# EAGLE design rfm69_32u4_pa (EAGLE 8.2.2)
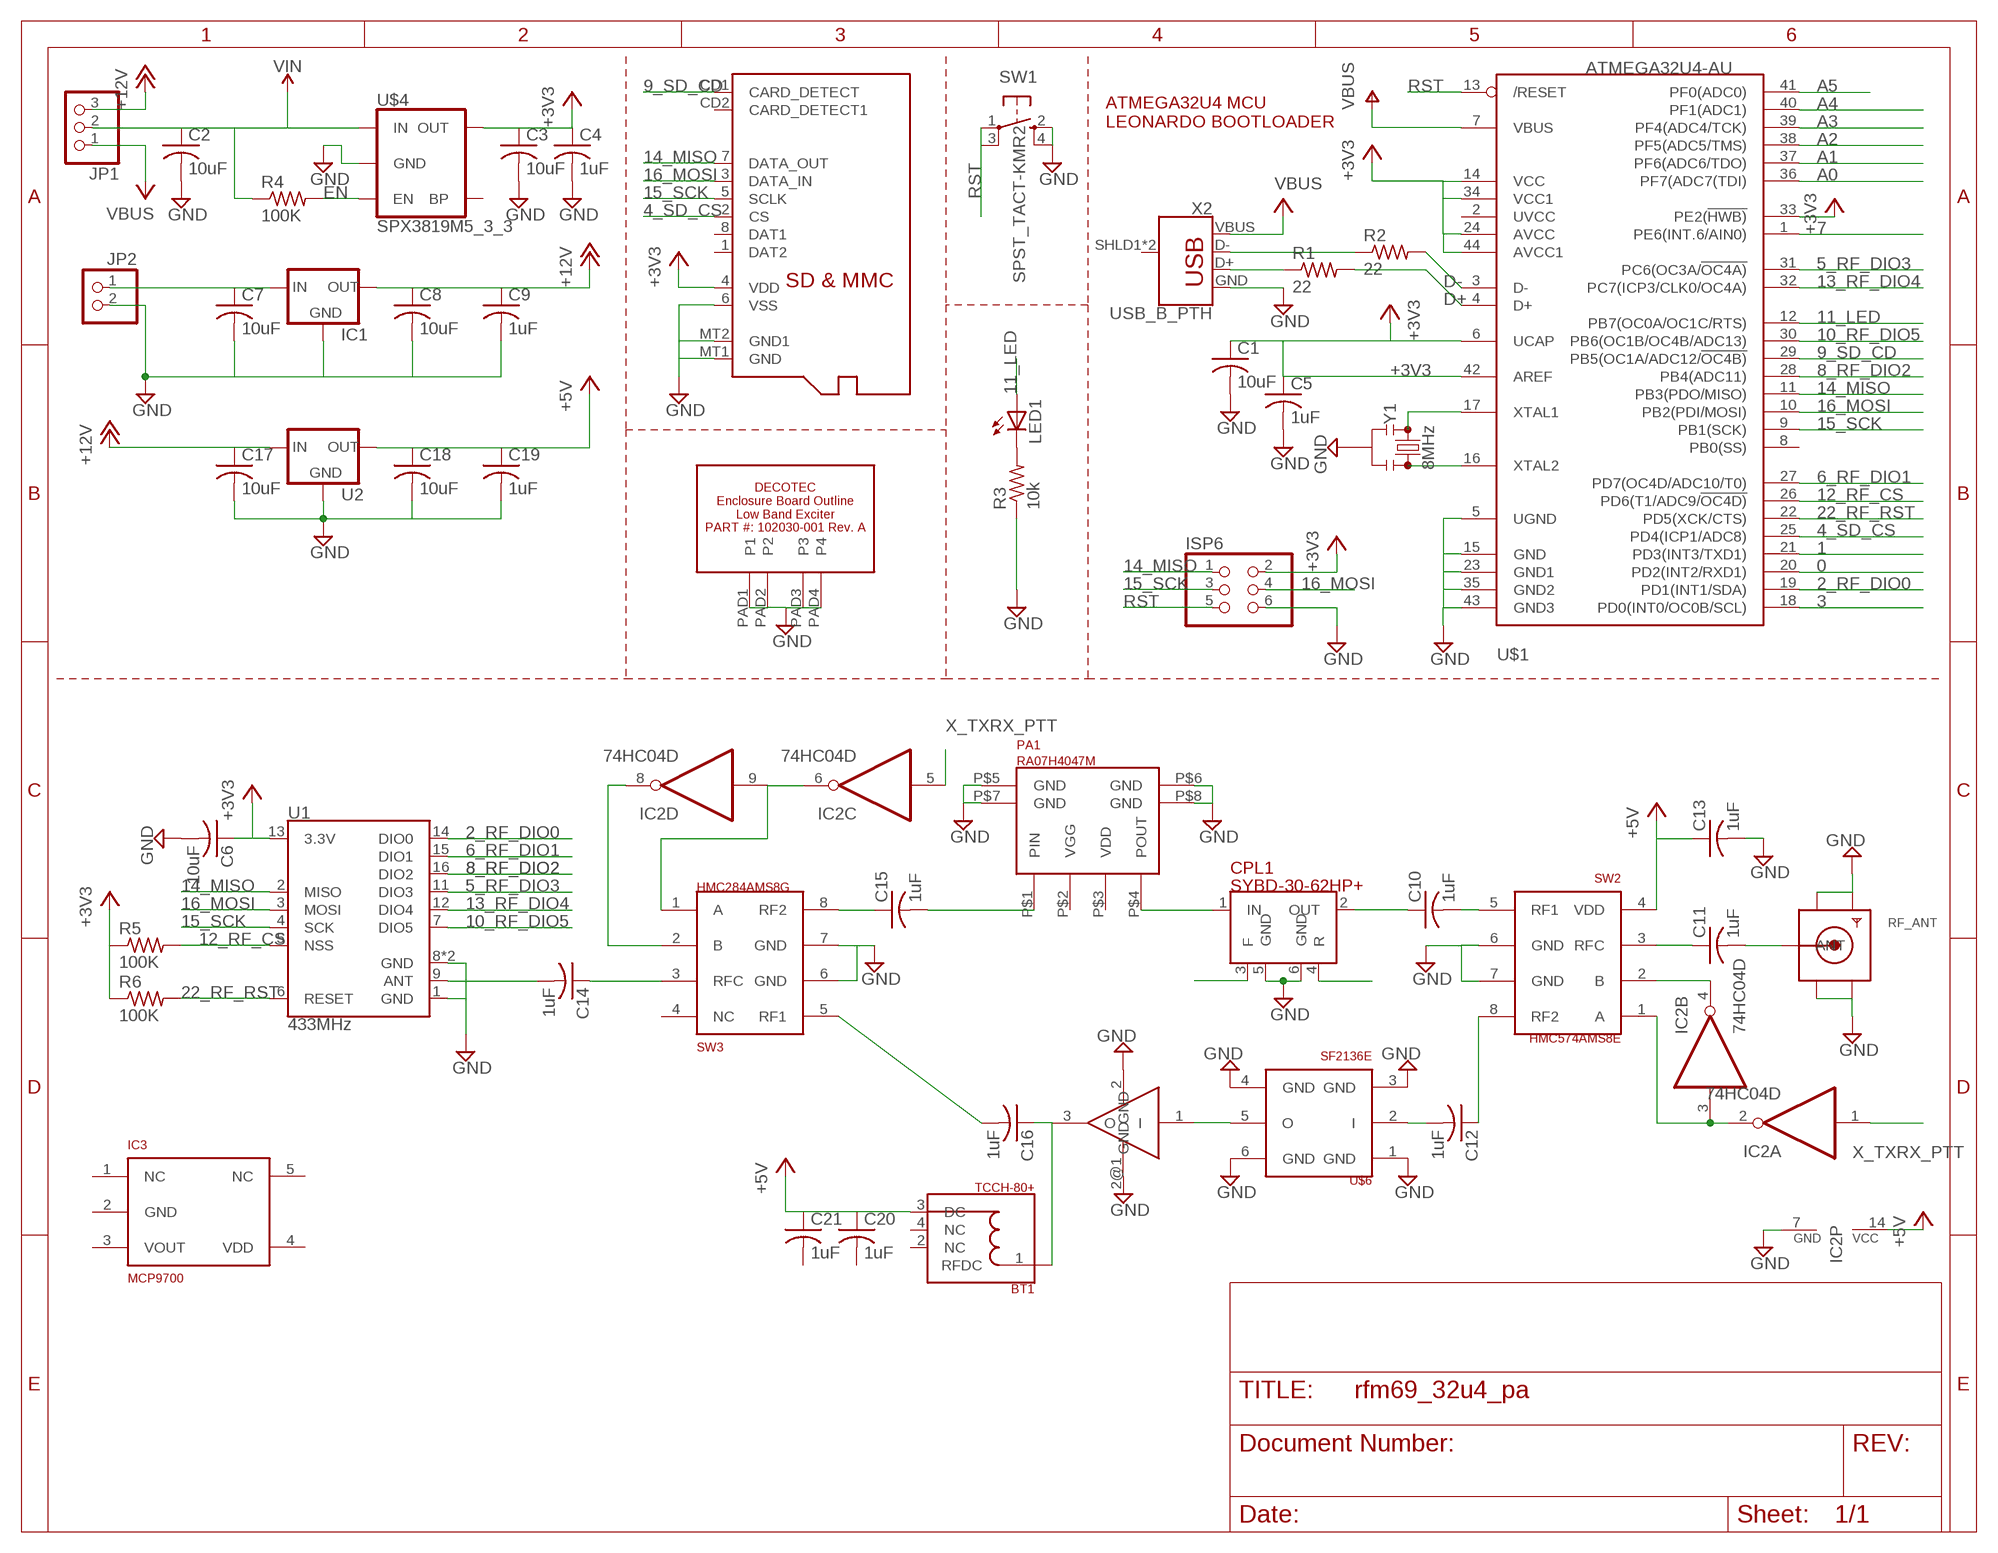
[diagram p0: schematic, sheet 1]

## Parts
BT1  TCCH-80+  [TCCH-80+]
C1  10uF  C-USC0805K  [C0805K]
C2  10uF  C-USC0805K  [C0805K]
C3  10uF  C-USC0805K  [C0805K]
C4  1uF  C-USC0805K  [C0805K]
C5  1uF  C-USC0805K  [C0805K]
C6  10uF  C-USC0805K  [C0805K]
C7  10uF  C-USC0805K  [C0805K]
C8  10uF  C-USC0805K  [C0805K]
C9  1uF  C-USC0805K  [C0805K]
C10  1uF  C-USC0805K  [C0805K]
C11  1uF  C-USC0805K  [C0805K]
C12  1uF  C-USC0805K  [C0805K]
C13  1uF  C-USC0805K  [C0805K]
C14  1uF  C-USC0805K  [C0805K]
C15  1uF  C-USC0805K  [C0805K]
C16  1uF  C-USC0805K  [C0805K]
C17  10uF  C-USC0805K  [C0805K]
C18  10uF  C-USC0805K  [C0805K]
C19  1uF  C-USC0805K  [C0805K]
C20  1uF  C-USC0805K  [C0805K]
C21  1uF  C-USC0805K  [C0805K]
CPL1  SYBD-30-62HP+  [SYBD-30-62HP+]
IC1  78XXL  [78XXL]
IC2  74HC04D  [SO14]
IC3  MCP9700  [SC70]
ISP6  PINHD-2X3  [2X03]
JP1  PINHD-1X3  [1X03]
JP2  PINHD-1X2  [1X02]
LED1  LEDCHIPLED_0805  [CHIPLED_0805]
PA1  RA07H4047M  [H46]
R1  22  R-US_R0805  [R0805]
R2  22  R-US_R0805  [R0805]
R3  10k  R-US_R0805  [R0805]
R4  100K  R-US_R0805  [R0805]
R5  100K  R-US_R0805  [R0805]
R6  100K  R-US_R0805  [R0805]
RF_ANT  SMACONNECTOR_EDGE  [SMA_EDGELAUNCH]
SW1  SPST_TACT-KMR2  [KMR2]
SW2  HMC574AMS8E  [MSOP8]
SW3  HMC284AMS8G  [MSOP8]
U1  433MHz  RFM69HCW-433  [RFM69HCW-XXXS2]
U2  V_REG_78XX-TO-220  [TO-220-ALT]
U$1  ATMEGA32U4-AU  [TQFP44]
U$2  DECOTEC_102030-001A  [DECOTEC_102030-001A]
U$3  MICROSD  [MICROSD]
U$4  SPX3819M5_3_3  V_REG_SPX3819-SOT23-5  [SOT23-5]
U$5  PGA-103+  [SOT89]
U$6  SF2136E  [SM3030-6]
X2  USB_B_PTH  [USB-B-PTH]
Y1  8MHz  RESONATOR-8MHZSMD_3.2X1.3  [RESONATOR-SMD-3.2X1.3]

## Nets
0: U$1.20(PD2(INT2/RXD1))
1: U$1.21(PD3(INT3/TXD1))
2_RF_DIO0: U1.14(DIO0) U$1.19(PD1(INT1/SDA))
3: U$1.18(PD0(INT0/OC0B/SCL))
4_SD_CS: U$1.25(PD4(ICP1/ADC8)) U$3.2(CS)
5_RF_DIO3: U1.11(DIO3) U$1.31(PC6(OC3A/!OC4A))
6_RF_DIO1: U1.15(DIO1) U$1.27(PD7(OC4D/ADC10/T0))
7: U$1.1(PE6(INT.6/AIN0))
8_RF_DIO2: U1.16(DIO2) U$1.28(PB4(ADC11))
9_SD_CD: U$1.29(PB5(OC1A/ADC12/!OC4B)) U$3.CD1(CARD_DETECT)
10_RF_DIO5: U1.7(DIO5) U$1.30(PB6(OC1B/OC4B/ADC13))
11_LED: LED1.A U$1.12(PB7(OC0A/OC1C/RTS))
12_RF_CS: R5.2 U1.5(NSS) U$1.26(PD6(T1/ADC9/!OC4D))
13_RF_DIO4: U1.12(DIO4) U$1.32(PC7(ICP3/CLK0/OC4A))
14_MISO: ISP6.1 U1.2(MISO) U$1.11(PB3(PDO/MISO)) U$3.7(DATA_OUT)
15_SCK: ISP6.3 U1.4(SCK) U$1.9(PB1(SCK)) U$3.5(SCLK)
16_MOSI: ISP6.4 U1.3(MOSI) U$1.10(PB2(PDI/MOSI)) U$3.3(DATA_IN)
22_RF_RST: R6.2 U1.6(RESET) U$1.22(PD5(XCK/CTS))
+3V3: C1.1 C3.1 C4.1 C5.1 C6.1 ISP6.2 R5.1 R6.1 U1.13(3.3V) U$1.6(UCAP) U$1.14(VCC) U$1.24(AVCC) U$1.33(PE2(!HWB)) U$1.34(VCC1) U$1.42(AREF) U$1.44(AVCC1) U$3.4(VDD) U$4.5(OUT)
+5V: BT1.3(DC) C13.1 C18.1 C19.1 C20.1 C21.1 IC2.14(P:VCC) SW2.4(VDD) U2.OUT
+12V: C8.1 C9.1 C17.1 IC1.OUT JP1.3 U2.IN
A0: U$1.36(PF7(ADC7(TDI))
A1: U$1.37(PF6(ADC6/TDO))
A2: U$1.38(PF5(ADC5/TMS))
A3: U$1.39(PF4(ADC4/TCK))
A4: U$1.40(PF1(ADC1))
A5: U$1.41(PF0(ADC0))
ANT: C14.2 U1.9(ANT)
CPL_FWD: CPL1.3(F)
CPL_REV: CPL1.4(R)
D+: R1.2 U$1.4(D+)
D-: R2.2 U$1.3(D-)
EN: R4.2 U$4.3(EN)
GND: C1.2 C2.2 C3.2 C4.2 C5.2 C6.2 C7.2 C8.2 C9.2 C13.2 C17.2 C18.2 C19.2 CPL1.5(GND) CPL1.6(GND) IC1.GND IC2.7(P:GND) ISP6.6 JP2.2 PA1.P$5(GND) PA1.P$6(GND) PA1.P$7(GND) PA1.P$8(GND) R3.1 RF_ANT.GND@1(GND4) RF_ANT.GND@2(GND3) RF_ANT.GND@3(GND2) RF_ANT.GND@4(GND1) SW1.2(S) SW1.4(S1) SW2.6(GND) SW2.7(GND) SW3.6(GND) SW3.7(GND) U1.1(GND) U1.8(GND) U1.10(GND) U2.GND U$1.5(UGND) U$1.15(GND) U$1.23(GND1) U$1.35(GND2) U$1.43(GND3) U$2.PAD1(P1) U$2.PAD2(P2) U$2.PAD3(P3) U$2.PAD4(P4) U$3.6(VSS) U$3.MT1(GND) U$3.MT2(GND1) U$4.2(GND) U$5.2(GND) U$5.2@1(GND) U$6.1(GND) U$6.3(GND) U$6.4(GND) U$6.6(GND) X2.GND Y1.2
N$1: R1.1 X2.D+
N$2: LED1.C R3.2
N$3: R2.1 X2.D-
N$4: C10.2 SW2.5(RF1)
N$5: C7.1 IC1.IN JP2.1
N$7: C12.1 SW2.8(RF2)
N$8: IC2.2(A:O) IC2.3(B:I) SW2.1(A)
N$9: IC2.4(B:O) SW2.2(B)
N$10: U$5.1(I) U$6.5(O)
N$11: C11.2 RF_ANT.P(ANT)
N$12: C11.1 SW2.3(RFC)
N$13: C14.1 SW3.3(RFC)
N$14: C15.1 SW3.8(RF2)
N$15: C15.2 PA1.P$1(PIN)
N$16: IC2.6(C:O) IC2.9(D:I) SW3.1(A)
N$17: BT1.1(RFDC) C16.1 U$5.3(O)
N$18: IC2.8(D:O) SW3.2(B)
N$19: C16.2 SW3.5(RF1)
N$20: C12.2 U$6.2(I)
RF_IN: CPL1.1(IN) PA1.P$4(POUT)
RF_OUT: C10.1 CPL1.2(OUT)
RST: ISP6.5 SW1.1(P) SW1.3(P1) U$1.13(/RESET)
VBUS: JP1.1 U$1.7(VBUS) X2.VBUS
VIN: C2.1 JP1.2 R4.1 U$4.1(IN)
X_TXRX_PTT: IC2.1(A:I) IC2.5(C:I)
XTAL1: U$1.17(XTAL1) Y1.1
XTAL2: U$1.16(XTAL2) Y1.3
Unconnected: BT1.2(NC) BT1.4(NC) C20.2 C21.2 IC2.10(E:O) IC2.11(E:I) IC2.12(F:O) IC2.13(F:I) IC3.1(NC) IC3.2(GND) IC3.3(VOUT) IC3.4(VDD) IC3.5(NC) PA1.P$2(VGG) PA1.P$3(VDD) SW3.4(NC) U$1.2(UVCC) U$1.8(PB0(SS)) U$3.1(DAT2) U$3.8(DAT1) U$3.CD2(CARD_DETECT1) U$4.4(BP) X2.SHLD1(SHIELD) X2.SHLD2(SHIELD)

## Notes on the sheet
- ATMEGA32U4 MCU
  LEONARDO BOOTLOADER

## Library data of the parts
BT1 = kj4qlp:TCCH-80+
C1-C21 = rcl:C-US: CAPACITOR, American symbol
CPL1 = kj4qlp:SYBD-30-62HP+
IC1 = v-reg:78XXL: VOLTAGE REGULATOR
IC2 = 74xx-eu:74*04: Hex INVERTER
IC3 = vtgs:MCP9700
ISP6 = pinhead:PINHD-2X3: PIN HEADER
JP1 = pinhead:PINHD-1X3: PIN HEADER
JP2 = pinhead:PINHD-1X2: PIN HEADER
LED1 = adafruit:LED: LED OSRAM: - CHIPLED LG R971, LG N971, LY N971, LG Q971, LY Q971, LO R971, LY R971 LH N974, LH R974 LS Q976, LO Q976, LY Q976 LO Q996 - Hyper CHIPLED LW Q18S LB Q993, LB Q99A, LB R99A - SideLED LS A670, LO A670, LY A670, LG A670, LP A670 LB A673, LV A673, LT A673, LW A673 LH A674 LY A675 LS A676, LA A676, LO A676, LY A676, LW A676 LS A679, LY A679, LG A679 - Hyper Micro SIDELED® LS Y876, LA Y876, LO Y876, LY Y876 LT Y87S - SmartLED LW L88C, LW L88S LB L89C, LB L89S, LG L890 LS L89K, LO L89K, LY L89K LS L896, LA L896, LO L896, LY L896 - TOPLED LS T670, LO T670, LY T670, LG T670, LP T670 LSG T670, LSP T670, LSY T670, LOP T670, LYG T670 LG T671, LOG T671, LSG T671 LB T673, LV T673, LT T673, LW T673 LH T674 LS T676, LA T676, LO T676, LY T676, LB T676, LH T676, LSB T676, LW T676 LB T67C, LV T67C, LT T67C, LS T67K, LO T67K, LY T67K, LW E67C LS E67B, LA E67B, LO E67B, LY E67B, LB E67C, LV E67C, LT E67C LW T67C LS T679, LY T679, LG T679 LS T770, LO T770, LY T770, LG T770, LP T770 LB T773, LV T773, LT T773, LW T773 LH T774 LS E675, LA E675, LY E675, LS T675 LS T776, LA T776, LO T776, LY T776, LB T776 LHGB T686 LT T68C, LB T68C - Hyper Mini TOPLED® LB M676 - Mini TOPLED Santana® LG M470 LS M47K, LO M47K, LY M47K Source: http://www.osram.convergy.de/
PA1 = kj4qlp:RA07H4047M
R1-R6 = adafruit:R-US_: RESISTOR, American symbol
RF_ANT = adafruit:SMACONNECTOR: SMA Connector 90° DIP SMA Connector, 50 Ohm (4UConnector: 07259)
SW1 = adafruit:SPST_TACT: SMT 6mm switch, EVQQ2 series http://www.ladyada.net/library/eagle
SW2 = kj4qlp:HMC574AMS8E
SW3 = kj4qlp:HMC284AMS8G
U1 = SparkFun-RF:RFM69H: Hope RF RFM69H ISM Transceiver Module The RFM69H is a transceiver module capable of operation over a wide frequency range, including the 315,433,868 and 915MHz license-free ISM (Industry Scientific and Medical) frequency bands. All major RF communication parameters are programmable and most of them can be dynamically set. The RFM69H offers the unique advantage of programmable narrow-band and wide- band communication modes. The RFM69H is optimized for low power consumption while offering high RF output power and channelized operation.Compliance ETSI and FCC regulations. Datasheet <http://www.hoperf.cn/upload/docs/RF/SX/RFM69H_DataSheet_v1.3.pdf> SparkFun Products RFM69HCW Wireless Transceiver - 915MHz <https://www.sparkfun.com/products/13909> (COM-13909) RFM69HCW Wireless Transceiver - 434MHz <https://www.sparkfun.com/products/13910> (COM-13910) SparkFun RFM69 Breakout (915MHz) <https://www.sparkfun.com/products/12775> (WRL-12775) SparkFun RFM69 Breakout (434MHz) <https://www.sparkfun.com/products/12823> (WRL-12823); PROD_ID: IC-12053
U2 = SparkFun-IC-Power:V_REG_78XX: Voltage Regulator Standard 78xx regulator. IGO (Input Ground Output). Spark Fun Electronics SKU : COM-00107; PROD_ID: VREG-08450; SF_ID: COM-00107
U$1 = adafruit:ATMEGA32U4: http://www.ladyada.net/library/eagle
U$2 = vtgs:DECOTEC_102030-001A
U$3 = adafruit:MICROSD: Micro-SD / Transflash card holder with SPI pinout For the 3M # 2908-05WB-MG and/or 4UCON #19656 push-push type
U$4 = SparkFun-IC-Power:V_REG_SPX3819: SPX3819 Voltage Regulator 3.3V 500mA, 16V input Datasheet <https://www.exar.com/content/document.ashx?id=22106> SparkFun Products: SparkFun Serial Controlled Motor Driver <https://www.sparkfun.com/products/13911>; PROD_ID: VREG-13321
U$5 = kj4qlp:PGA-103+
U$6 = kj4qlp:SF2136E
X2 = SparkFun-Connectors:USB_B: USB Type B Connector SparkFun Products: SparkFun Stepoko <https://www.sparkfun.com/products/13899> PTH; PROD_ID: CONN-08278; SF_ID: PRT-00139
Y1 = SparkFun-Clocks:RESONATOR-8MHZ: 8MHz Resonator Digikey Example <http://www.digikey.com/product-detail/en/murata-electronics-north-america/CSTCE10M0G55-R0/490-1196-1-ND/584633> Frequency: 8MHz Frequency Stability: ±0.2% Frequency Tolerance: ±0.5% Capacitance: 33pF SparkFun Products Arduino Pro Mini 328- 3.3V/8MHz <https://www.sparkfun.com/products/11114> SparkFun Digital Sandbox <https://www.sparkfun.com/products/12651>; PROD_ID: XTAL-08895

## Board
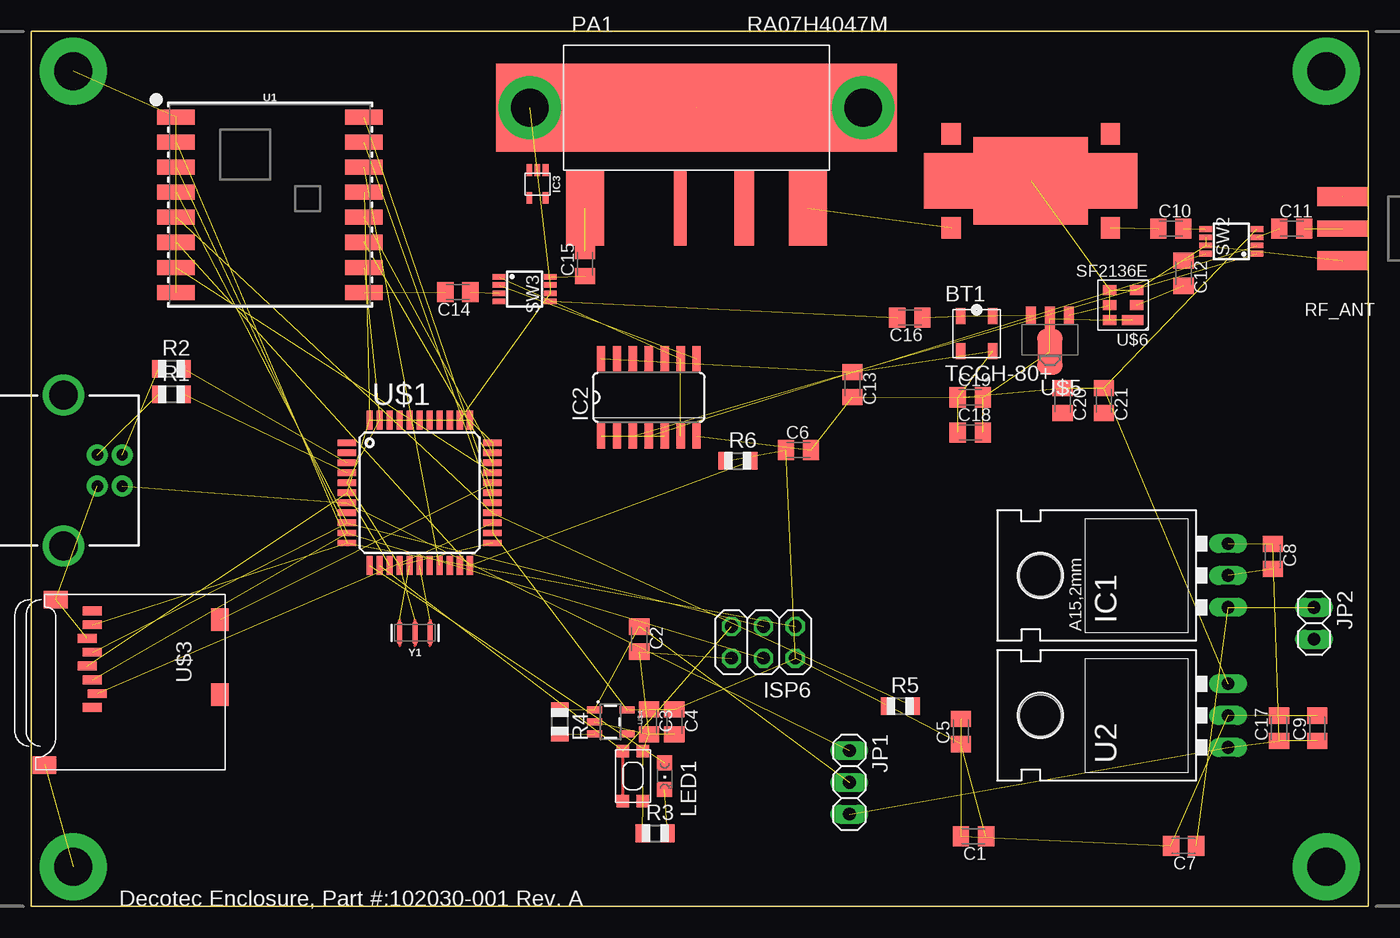
[diagram p1: board, top side]
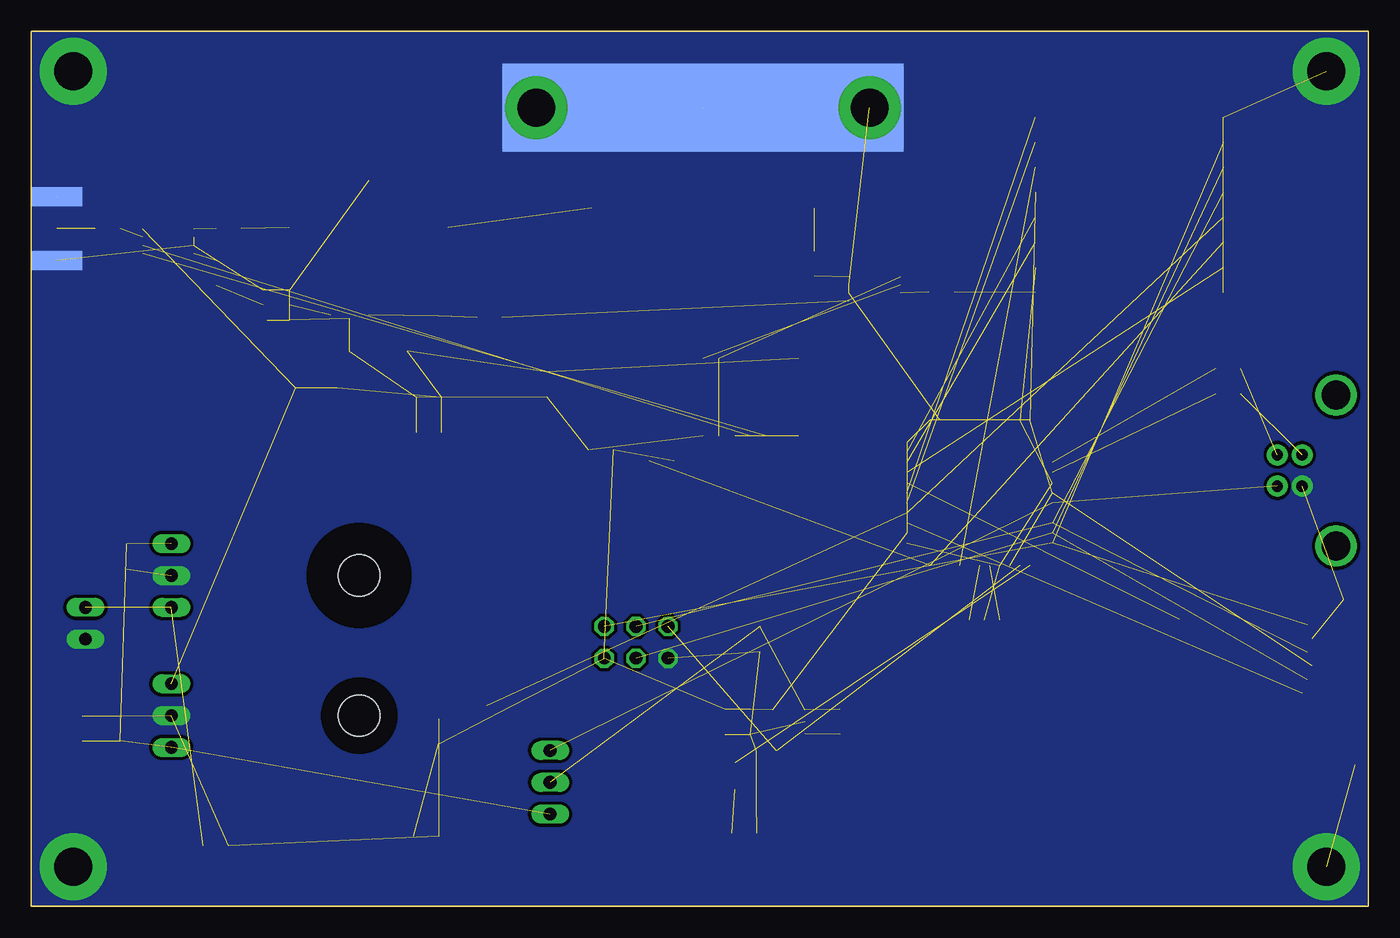
[diagram p2: board, bottom side, seen from below]

Size 106.68 x 69.85 mm. Coordinates in mm from the lower left corner, seen from the top.
Copper layers (1*16): Top 0.035mm / dielectric 1.5mm / Bottom 0.035mm
Design rules "default *": minimum track width 6mil, minimum drill 10mil, track to track 10mil, track to pad 6mil, pad to pad 6mil, via to via 6mil, smd to smd 6mil, copper to edge 1mil, drill to drill 6mil, minimum pad ring 10mil, minimum via ring 8mil, stop-mask expansion 4mil, vias tented up to drill 0mil, thermal gap 10mil

### Footprints (pad centres in the part's own frame; a part is rotated, then mirrored left to right if it is on the bottom)
TCCH-80+ = smd 0.762 x 1.27: 1 -1.27,1.397; 2 -1.27,-1.397; 3 1.27,-1.397; 4 1.27,1.397
C0805K = smd 1.3 x 1.6: 1 -1,0; 2 1,0
SYBD-30-62HP+ = smd 1.524 x 1.702: 1 -6.35,-3.747; 2 6.35,-3.747; 3 6.35,3.747; 4 -6.35,3.747 | smd 17.018 x 4.445: 5 0,0 | smd 9.144 x 6.985: 6 0,0
78XXL = drill 1.016 long: GND 0,-3.81; IN -2.54,-3.81; OUT 2.54,-3.81 | hole 3.302: 0,11.176
SO14 = smd 0.66 x 2.032: 1 -3.81,-3.073; 2 -2.54,-3.073; 3 -1.27,-3.073; 4 0,-3.073; 5 1.27,-3.073; 6 2.54,-3.073; 7 3.81,-3.073; 8 3.81,3.073; 9 2.54,3.073; 10 1.27,3.073; 11 0,3.073; 12 -1.27,3.073; 13 -2.54,3.073; 14 -3.81,3.073
SC70 = smd 0.45 x 0.95: 1 0.65,1.1; 2 0,1.1; 3 -0.65,1.1; 4 -0.65,-1.1; 5 0.65,-1.1
2X03 = drill 1.016 octagon: 1 -2.54,-1.27; 2 -2.54,1.27; 3 0,-1.27; 4 0,1.27; 5 2.54,-1.27; 6 2.54,1.27
1X03 = drill 1.016 long: 1 -2.54,0; 2 0,0; 3 2.54,0
1X02 = drill 1.016 long: 1 -1.27,0; 2 1.27,0
CHIPLED_0805 = smd 1.2 x 1.2: A 0,-1.05; C 0,1.05
H46 = smd 3.048 x 6: P$1 -8.9,-8; P$4 8.9,-8 | smd 1.016 x 6: P$2 -1.3,-8 | smd 1.524 x 6: P$3 3.8,-8 | smd 32 x 7: P$5 0,0 | smd 32 x 7 bottom: P$6 0,0 | drill 3 pad 5: P$7 -13.3,0; P$8 13.3,0
R0805 = smd 1.1 x 1.4: 1 -1,0; 2 1,0
SMA_EDGELAUNCH = smd 4.064 x 1.524: GND@1 2.032,-2.54; GND@2 2.032,2.54 | smd 4.064 x 1.524 bottom: GND@3 2.032,2.54; GND@4 2.032,-2.54 | smd 4.064 x 1.27: P 2.032,0
KMR2 = smd 1 x 1: 1 2,0.8; 2 2,-0.8; 3 -2,0.8; 4 -2,-0.8
MSOP8 = smd 0.45 x 1: 1 -0.975,-2.05; 2 -0.325,-2.05; 3 0.325,-2.05; 4 0.975,-2.05; 5 0.975,2.05; 6 0.325,2.05; 7 -0.325,2.05; 8 -0.975,2.05
RFM69HCW-XXXS2 = smd 3 x 1.2: 1 -7.5,7; 2 -7.5,5; 3 -7.5,3; 4 -7.5,1; 5 -7.5,-1; 6 -7.5,-3; 7 -7.5,-5; 8 -7.5,-7; 9 7.5,-7; 10 7.5,-5; 11 7.5,-3; 12 7.5,-1; 13 7.5,1; 14 7.5,3; 15 7.5,5; 16 7.5,7
TO-220-ALT = drill 1.016 long: GND 0,-3.81; IN -2.54,-3.81; OUT 2.54,-3.81 | hole 3.302: 0,11.176
TQFP44 = smd 1.5 x 0.5: 1 -5.8,4; 2 -5.8,3.2; 3 -5.8,2.4; 4 -5.8,1.6; 5 -5.8,0.8; 6 -5.8,0; 7 -5.8,-0.8; 8 -5.8,-1.6; 9 -5.8,-2.4; 10 -5.8,-3.2; 11 -5.8,-4; 23 5.8,-4; 24 5.8,-3.2; 25 5.8,-2.4; 26 5.8,-1.6; 27 5.8,-0.8; 28 5.8,0; 29 5.8,0.8; 30 5.8,1.6; 31 5.8,2.4; 32 5.8,3.2; 33 5.8,4 | smd 0.5 x 1.5: 12 -4,-5.8; 13 -3.2,-5.8; 14 -2.4,-5.8; 15 -1.6,-5.8; 16 -0.8,-5.8; 17 0,-5.8; 18 0.8,-5.8; 19 1.6,-5.8; 20 2.4,-5.8; 21 3.2,-5.8; 22 4,-5.8; 34 4,5.8; 35 3.2,5.8; 36 2.4,5.8; 37 1.6,5.8; 38 0.8,5.8; 39 0,5.8; 40 -0.8,5.8; 41 -1.6,5.8; 42 -2.4,5.8; 43 -3.2,5.8; 44 -4,5.8
DECOTEC_102030-001A = drill 3.048 pad 5.334: PAD1 10.319,3.175; PAD2 10.319,66.675; PAD3 110.331,66.675; PAD4 110.331,3.175
MICROSD = smd 0.7 x 1.5: 1 9,-10.64; 2 7.9,-10.24; 3 6.8,-10.64; 4 5.7,-11.04; 5 4.6,-10.64; 6 3.5,-11.04; 7 2.4,-10.64; 8 1.3,-10.64 | smd 1.8 x 1.4: CD1 2,-0.44; CD2 8,-0.44 | smd 1.4 x 1.9: MT1 0.4,-13.54; MT2 13.6,-14.44
SOT23-5 = smd 0.55 x 1.2: 1 -0.95,-1.3; 2 0,-1.3; 3 0.95,-1.3; 4 0.95,1.3; 5 -0.95,1.3
SOT89 = smd 0.8 x 1.4: 1 -1.499,-1.981; 3 1.499,-1.981 | smd 0.8 x 1.9: 2 0,-1.727 | smd 2.032 x 3.65: 2@1 0,0.94
SM3030-6 = smd 1.7 x 0.81: 1 -0.75,1.195 | smd 1.05 x 0.81: 2 -1.075,0; 3 -1.075,-1.195; 4 1.075,-1.195; 5 1.075,0; 6 1.075,1.195
USB-B-PTH = drill 0.914 pad 1.676: D+ 4,1.25; D- 5.981,1.25; GND 4,-1.25; VBUS 5.981,-1.25 | drill 2.286: SHLD1 1.282,-6.02; SHLD2 1.282,6.02
RESONATOR-SMD-3.2X1.3 = smd 0.45 x 1.905: 1 -1.2,0; 2 0,0; 3 1.2,0

### Placement (x,y rotation side)
BT1  75.44,45.72 0 top
C1  75.18,5.59 180 top
C2  48.51,21.34 270 top
C3  49.28,14.73 270 top
C4  51.31,14.73 270 top
C5  74.17,13.97 90 top
C6  61.21,36.43 0 top
C7  91.95,4.83 180 top
C8  99.06,27.94 270 top
C9  102.62,14.22 90 top
C10  90.93,54.1 0 top
C11  100.58,54.1 0 top
C12  91.95,50.55 270 top
C13  65.53,41.66 270 top
C14  34.04,49.02 180 top
C15  44.2,51.31 90 top
C16  70.1,46.99 180 top
C17  99.57,14.22 90 top
C18  74.93,37.85 0 top
C19  74.93,40.64 0 top
C20  82.3,40.39 270 top
C21  85.6,40.39 270 top
CPL1  79.76,57.91 0 top
IC1  91.69,26.42 90 top
IC2  49.28,40.64 0 top
IC3  40.39,57.66 0 top
ISP6  58.42,21.08 180 top
JP1  65.28,9.91 270 top
JP2  102.36,22.61 270 top
LED1  50.55,10.41 180 top
PA1  53.09,63.75 0 top
R1  11.18,40.89 0 top
R2  11.18,42.93 0 top
R3  49.78,5.84 0 top
R4  42.16,14.73 270 top
R5  69.34,16 0 top
R6  56.39,35.56 0 top
RF_ANT  106.68,54.1 180 top
SW1  48.01,10.41 90 top
SW2  95.76,53.09 90 top
SW3  39.37,49.28 270 top
U1  19.05,56.01 0 top
U2  91.69,15.24 90 top
U$1  30.99,33.02 0 top
U$2  -6.99,0 0 top
U$3  15.49,24.89 270 top
U$4  46.23,14.73 270 top
U$5  81.28,45.21 180 top
U$6  87.12,48.01 180 top
X2  1.27,34.8 0 top
Y1  30.61,21.84 180 top

### Tracks (layer width: path | path; a pad name or v marks a point on that pad's centre or on a via)
2_RF_DIO0  (1 unrouted)
4_SD_CS  (1 unrouted)
5_RF_DIO3  (1 unrouted)
6_RF_DIO1  (1 unrouted)
8_RF_DIO2  (1 unrouted)
9_SD_CD  (1 unrouted)
10_RF_DIO5  (1 unrouted)
11_LED  (1 unrouted)
12_RF_CS  (2 unrouted)
13_RF_DIO4  (1 unrouted)
14_MISO  (3 unrouted)
15_SCK  (3 unrouted)
16_MOSI  (3 unrouted)
22_RF_RST  (2 unrouted)
+3V3  (17 unrouted)
+5V  (8 unrouted)
+12V  (5 unrouted)
ANT  (1 unrouted)
D+  (1 unrouted)
D-  (1 unrouted)
EN  (1 unrouted)
GND  (44 unrouted)
  pour Bottom (no thermals): 0,0 0,69.85 106.68,69.85 106.68,0
N$1  (1 unrouted)
N$2  (1 unrouted)
N$3  (1 unrouted)
N$4  (1 unrouted)
N$5  (2 unrouted)
N$7  (1 unrouted)
N$8  (2 unrouted)
N$9  (1 unrouted)
N$10  (1 unrouted)
N$11  (1 unrouted)
N$12  (1 unrouted)
N$13  (1 unrouted)
N$14  (1 unrouted)
N$15  (1 unrouted)
N$16  (2 unrouted)
N$17  (2 unrouted)
N$18  (1 unrouted)
N$19  (1 unrouted)
N$20  (1 unrouted)
RF_IN  (1 unrouted)
RF_OUT  (1 unrouted)
RST  (2 unrouted)
  Top 0.254: SW1.3 SW1.1
VBUS  (2 unrouted)
VIN  (3 unrouted)
X_TXRX_PTT  (1 unrouted)
XTAL1  (1 unrouted)
XTAL2  (1 unrouted)